# Altium schematic sheet state indicator.SchDoc
size A
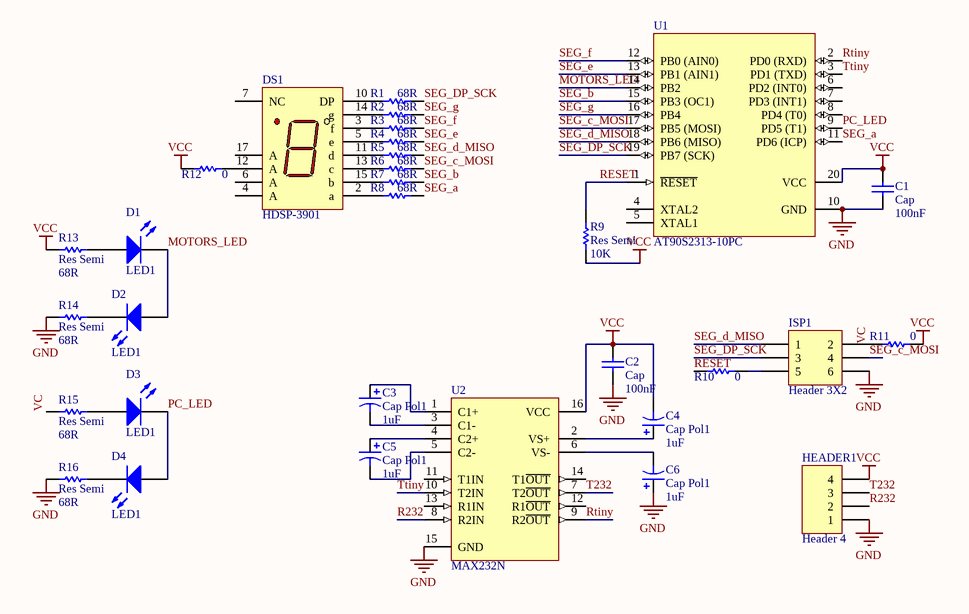
[diagram p0: state indicator.SchDoc]

## Parts
C1  Cap  value 100nF  [CAPR5.08-7.8x3.2]
C2  Cap  value 100nF  [CAPR5.08-7.8x3.2]
C3  Cap Pol1  value 1uF  [CAPPR2-5x6.8]
C4  Cap Pol1  value 1uF  [CAPPR2-5x6.8]
C5  Cap Pol1  value 1uF  [CAPPR2-5x6.8]
C6  Cap Pol1  value 1uF  [CAPPR2-5x6.8]
D1  LED1  [LED-1]
D2  LED1  [LED-1]
D3  LED1  [LED-1]
D4  LED1  [LED-1]
DS1  HDSP-3901  [N-13]
HEADER1  Header 4  [HDR1X4]
ISP1  Header 3X2  [HDR2X3]
R1  value 68R  [RES10-7.8X2.8]  (hidden comment: es Semi)
R2  value 68R  [RES10-7.8X2.8]  (hidden comment: Res Semi)
R3  value 68R  [RES10-7.8X2.8]  (hidden comment: Res Semi)
R4  value 68R  [RES10-7.8X2.8]  (hidden comment: Res Semi)
R5  value 68R  [RES10-7.8X2.8]  (hidden comment: Res Semi)
R6  value 68R  [RES10-7.8X2.8]  (hidden comment: Res Semi)
R7  value 68R  [RES10-7.8X2.8]  (hidden comment: Res Semi)
R8  value 68R  [RES10-7.8X2.8]  (hidden comment: Res Semi)
R9  Res Semi  value 10K  [RES10-7.8X2.8]
R10  value 0  [RES10-7.8X2.8]  (hidden comment: Res Semi)
R11  value 0  [RES10-7.8X2.8]  (hidden comment: Res Semi)
R12  value 0  [RES10-7.8X2.8]  (hidden comment: Res Semi)
R13  Res Semi  value 68R  [RES10-7.8X2.8]
R14  Res Semi  value 68R  [RES10-7.8X2.8]
R15  Res Semi  value 68R  [RES10-7.8X2.8]
R16  Res Semi  value 68R  [RES10-7.8X2.8]
U1  AT90S2313-10PC  [DIP-20/D32.6]
U2  MAX232N  [N016]

## Nets
GND: C1.2 C2.2 C6.1 HEADER1.1 ISP1.6 R14.1 R16.1 U1.10(GND) U2.15(GND)
VCC: C1.1 C2.1 C4.2 HEADER1.4 R9.1 R11.2 R12.1 R13.1 U1.20(VCC) U2.16(VCC)
MOTORS_LED: D1.2(K) D2.1(A) U1.14(PB2)
PC_LED: D3.2(K) D4.1(A) U1.9(PD5_(T1))
R232: HEADER1.2 U2.8(R2IN)
RESET: R9.2 R10.1 U1.1(~{RESET})
Rtiny: U1.2(PD0_(RXD)) U2.9(R2~{OUT})
SEG_a: R8.2 U1.11(PD6_(ICP))
SEG_b: R7.2 U1.15(PB3_(OC1))
SEG_c_MOSI: ISP1.4 R6.2 U1.17(PB5_(MOSI))
SEG_d_MISO: ISP1.1 R5.2 U1.18(PB6_(MISO))
SEG_DP_SCK: ISP1.3 R1.2 U1.19(PB7_(SCK))
SEG_e: R4.2 U1.13(PB1_(AIN1))
SEG_f: R3.2 U1.12(PB0_(AIN0))
SEG_g: R2.2 U1.16(PB4)
T232: HEADER1.3 U2.7(T2~{OUT})
Ttiny: U1.3(PD1_(TXD)) U2.10(T2IN)
VC: ISP1.2 R11.1 R15.1
NetC3_1: C3.1 U2.1(C1+)
NetC3_2: C3.2 U2.3(C1-)
NetC4_1: C4.1 U2.2(VS+)
NetC5_1: C5.1 U2.4(C2+)
NetC5_2: C5.2 U2.5(C2-)
NetC6_2: C6.2 U2.6(VS-)
NetD1_1: D1.1(A) R13.2
NetD2_2: D2.2(K) R14.2
NetD3_1: D3.1(A) R15.2
NetD4_2: D4.2(K) R16.2
NetDS1_2: DS1.2(a) R8.1
NetDS1_3: DS1.3(f) R3.1
NetDS1_5: DS1.5(e) R4.1
NetDS1_10: DS1.10(DP) R1.1
NetDS1_11: DS1.11(d) R5.1
NetDS1_12: DS1.12(A) R12.2
NetDS1_13: DS1.13(c) R6.1
NetDS1_14: DS1.14(g) R2.1
NetDS1_15: DS1.15(b) R7.1
NetISP1_5: ISP1.5 R10.2

Not connected (* = marked no-connect by the designer): DS1 4(A) 6(A) 7(NC) 17(A); U1 4(XTAL2) 5(XTAL1) 6(PD2_(INT0)) 7(PD3_(INT1)) 8(PD4_(T0)); U2 11(T1IN) 12(R1~{OUT}) 13(R1IN) 14(T1~{OUT})

## Library data of the parts
C1 C2 = Cap: Capacitor; Published: 8-Jun-2000; LatestRevisionDate: 17-Jul-2002; LatestRevisionNote: Re-released for DXP Platform.; PackageReference: RAD-0.3; Publisher: Altium Limited
C3-C6 = Cap Pol1: Polarized Capacitor (Radial); Published: 8-Jun-2000; LatestRevisionDate: 17-Jul-2002; LatestRevisionNote: Re-released for DXP Platform.; PackageReference: RB7.6-15; Publisher: Altium Limited
D1-D4 = LED1: Typical RED GaAs LED; Published: 8-Jun-2000; LatestRevisionDate: 08-Jul-2005; LatestRevisionNote: Mech Layer 1 removed.; PackageReference: LED-1; Publisher: Altium Limited
DS1 = HDSP-3901: 20.32 mm Gray Package HER 7-Segment Display: CA, RH DP; LuminousIntensity: 3350 ucd (Minimum).; LED_Colour: High Efficiency Red (HER); Note: Pins 4, 6, 12 and 17 are redundant Anodes.; Note: No pins are present in positions 1, 8, 9, 16 and 18.; Published: 26-May-2004; LatestRevisionDate: 11-Oct-2004; LatestRevisionNote: Display outline superimposed on PCB Footprint.; DatasheetDocument: 26-Jul-2001; PackageDocument: 26-Jul-2001; PackageReference: N-13; Publisher: Altium Limited; ComponentLink1Description: Manufacturer Link; ComponentLink1URL: http://www.agilent.com/; ComponentLink2Description: Datasheet; ComponentLink2URL: http://cp.literature.agilent.com/litweb/pdf/5988-1737EN.pdf
HEADER1 = Header 4: Header, 4-Pin; LatestRevisionDate: 17-Jul-2002; LatestRevisionNote: Re-released for DXP Platform.; Publisher: Altium Limited
ISP1 = Header 3X2: Header, 3-Pin, Dual row; LatestRevisionDate: 17-Jul-2002; LatestRevisionNote: Re-released for DXP Platform.; Publisher: Altium Limited
R1-R16 = Res Semi: Semiconductor Resistor; Published: 8-Jun-2000; LatestRevisionDate: 17-Jul-2002; LatestRevisionNote: Re-released for DXP Platform.; PackageReference: AXIAL-0.5; Publisher: Altium Limited
U1 = AT90S2313-10PC: 8-Bit AVR Microcontroller with 2K Bytes of In-System Programmable Flash Memory; Published: 17-Sep-2003; LatestRevisionDate: 04-Mar-2005; LatestRevisionNote: Stylized 3D Model Added.; DatasheetVersion: 0839I-AVR-06/02; PackageVersion: Aug-1999; PackageReference: 20P3; Publisher: Altium Limited; PackageDescription: DIP; 20 Leads; Row Spacing 7.62 mm; Pitch 2.54 mm; Code_JEDEC: MS-001-AD; ComponentLink1Description: Manufacturer Link; ComponentLink1URL: http://www.atmel.com; ComponentLink2Description: Datasheet; ComponentLink2URL: http://www.atmel.com/dyn/resources/prod_documents/doc0839.pdf
U2 = MAX232N: Dual EIA-232 Driver/Receiver; Note: Receivers have typical hysteresis of 0.5V; Published: 15-May-2002; LatestRevisionDate: 04-Mar-2005; LatestRevisionNote: Stylized 3D Model Added.; DatasheetVersion: Jun-1989; PackageVersion: Oct-1995; PackageReference: N016; Publisher: Altium Limited; PackageDescription: DIP; 16 Leads; Row Spacing 7.62 mm; Pitch 2.54 mm; Code_JEDEC: MS-001-BB; ComponentLink1Description: Manufacturer Link; ComponentLink1URL: http://www.ti.com/; ComponentLink2Description: Datasheet; ComponentLink2URL: http://www-s.ti.com/sc/ds/max232.pdf